# Altium schematic sheet 7 segment display.schdoc
size A4
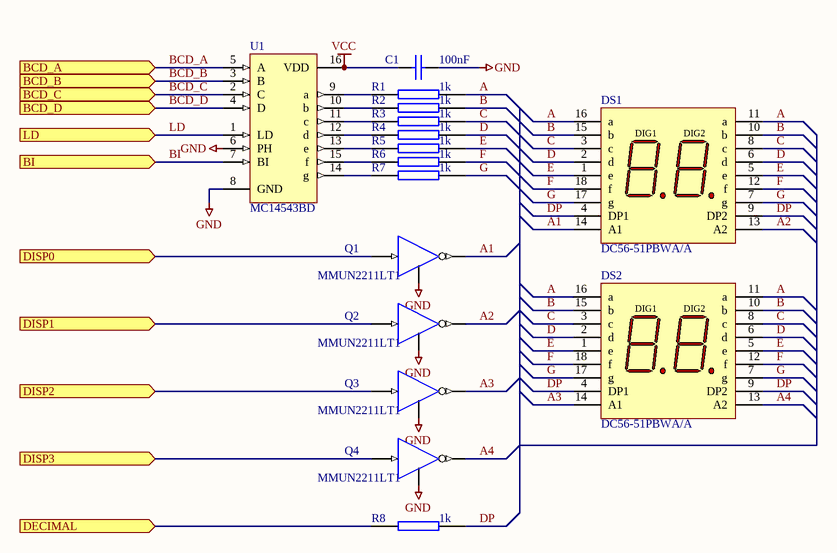
[diagram p0: 7 segment display.schdoc]

## Parts
C1  100nF  [CAP (3D) - 0603]
DS1  DC56-51PBWA/A  [K-18 (3D)]
DS2  DC56-51PBWA/A  [K-18 (3D)]
Q1  MMUN2211LT1  [SOT23-3L]
Q2  MMUN2211LT1  [SOT23-3L]
Q3  MMUN2211LT1  [SOT23-3L]
Q4  MMUN2211LT1  [SOT23-3L]
R1  1k  [RES (3D) - 0603]
R2  1k  [RES (3D) - 0603]
R3  1k  [RES (3D) - 0603]
R4  1k  [RES (3D) - 0603]
R5  1k  [RES (3D) - 0603]
R6  1k  [RES (3D) - 0603]
R7  1k  [RES (3D) - 0603]
R8  1k  [RES (3D) - 0603]
U1  MC14543BD  [751B-05_N]

## Ports
BCD_A (in), BCD_B (in), BCD_C (in), BCD_D (in), BI (in), DECIMAL (in), DISP0 (in), DISP1 (in), DISP2 (in), DISP3 (in), LD (in)

## Nets
GND: C1.2 Q1.2(E) Q2.2(E) Q3.2(E) Q4.2(E) U1.6(PH) U1.8(GND)
VCC: C1.1 U1.16(VDD)
A: DS1.11(a) DS1.16(a) DS2.11(a) DS2.16(a) R1.2
A1: DS1.14(A1) Q1.3(C)
A2: DS1.13(A2) Q2.3(C)
A3: DS2.14(A1) Q3.3(C)
A4: DS2.13(A2) Q4.3(C)
B: DS1.10(b) DS1.15(b) DS2.10(b) DS2.15(b) R2.2
BCD_A: U1.5(A) ; port BCD_A
BCD_B: U1.3(B) ; port BCD_B
BCD_C: U1.2(C) ; port BCD_C
BCD_D: U1.4(D) ; port BCD_D
BI: U1.7(BI) ; port BI
C: DS1.3(c) DS1.8(c) DS2.3(c) DS2.8(c) R3.2
D: DS1.2(d) DS1.6(d) DS2.2(d) DS2.6(d) R4.2
DECIMAL: R8.1 ; port DECIMAL
DISP0: Q1.1(B) ; port DISP0
DISP1: Q2.1(B) ; port DISP1
DISP2: Q3.1(B) ; port DISP2
DISP3: Q4.1(B) ; port DISP3
DP: DS1.4(DP1) DS1.9(DP2) DS2.4(DP1) DS2.9(DP2) R8.2
E: DS1.1(e) DS1.5(e) DS2.1(e) DS2.5(e) R5.2
F: DS1.12(f) DS1.18(f) DS2.12(f) DS2.18(f) R6.2
G: DS1.7(g) DS1.17(g) DS2.7(g) DS2.17(g) R7.2
LD: U1.1(LD) ; port LD
NetR1_1: R1.1 U1.9(a)
NetR2_1: R2.1 U1.10(b)
NetR3_1: R3.1 U1.11(c)
NetR4_1: R4.1 U1.12(d)
NetR5_1: R5.1 U1.13(e)
NetR6_1: R6.1 U1.15(f)
NetR7_1: R7.1 U1.14(g)

## Notes on the sheet
- (in symbol HDSP-521A) DIG1; DIG2

## Library data of the parts
C1 = CAP SMD 0603 100nF: CAPACITOR SMD 0603; Manufacturer: Murata; Manufacturer Part No.: GCM188R71C104KA37D; Mouser Part no.: 81-GCM188R71C104KA7D; Web link: http://au.mouser.com/ProductDetail/Murata/GCM188R71C104KA37D/?qs=aEuGZpxfbxWKAxwYn%252beTMg%3d%3d; value: 100nF
DS1 DS2 = HDSP-521A: 14.22 mm 2-Digit General Purpose Blue 7-Segment Display; Manufacturer: Kingbright; Manufacturer Part No.: DC56-51PBWA/A; Mouser Part no.: 604-DC56-51PWA/A; value: DC56-51PBWA/A; Web link: http://au.mouser.com/ProductDetail/Kingbright/DC56-51PBWA-A/?qs=sGAEpiMZZMvkC18yXH9iImaSvJt1jDBMn4pTsm9NSeE%3d
Q1-Q4 = NPN DIGITAL TRANSISTOR: Manufacturer: ON Semiconductor; Manufacturer Part No.: MUN5211T1G; value: MMUN2211LT1G; Mouser Part no.: 863-MUN5211T1G; Web Link: http://au.mouser.com/ProductDetail/ON-Semiconductor/MUN5211T1G/?qs=sGAEpiMZZMt32xmUYxteed765t4s7ZSB2i30a5%252bW6aQ%3d
R1-R8 = RES SMD 0603 1k: RESISTOR SMD 0603 1k; Manufacturer: Bourns; Manufacturer Part No.: CR0603-JW-102ELF; Mouser Part no.: 652-CR0603-JW-102ELF; Web link: http://au.mouser.com/ProductDetail/Bourns/CR0603-JW-102ELF/?qs=sGAEpiMZZMu61qfTUdNhG2nPoCjtvs%252bRXTOJv8O9Kbk%3d; value: 1k
U1 = MC14543BD: BCD-to-7-Segment Latch/Decoder/Driver for Liquid Crystals; Manufacturer: TEXAS INSTRUMENTS; Manufacturer Part No.: CD4543BPWR; value: CD4543BPWR; Mouser Part no.: 595-CD4543BPWR; Web link: http://au.mouser.com/ProductDetail/Texas-Instruments/CD4543BPWR/?qs=sGAEpiMZZMtxONTBFIcRfsIzUmYcFeAD7hbzjqG8ERQ%3d